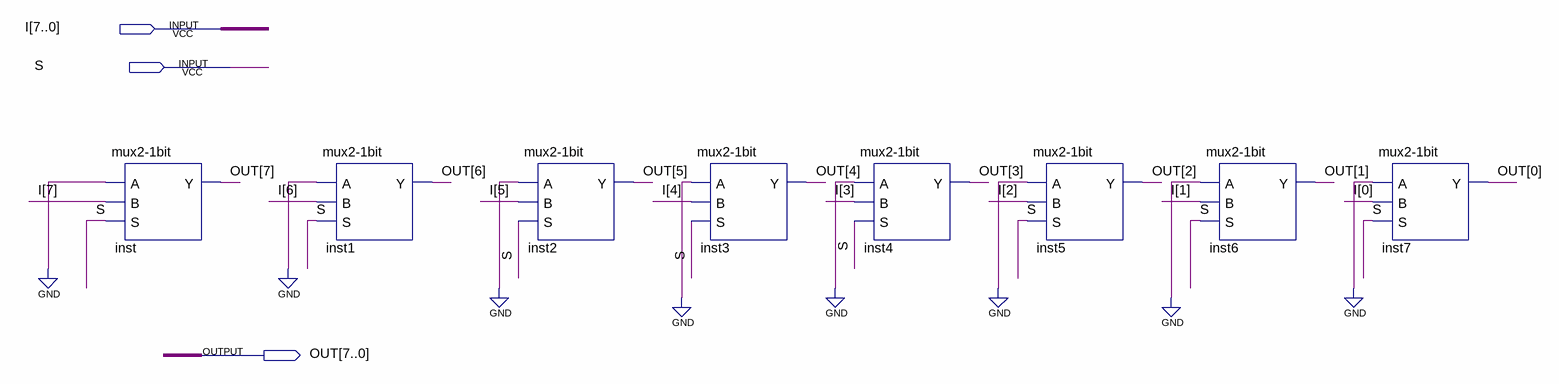
[diagram p0: schematic sheet]
// Quartus schematic MUX_8BITS.bdf as structural Verilog: 8 symbols, 3 pins
module MUX_8BITS (
  input  [7:0] I,
  input  S,
  output [7:0] OUT
);

  \mux2-1bit  inst (.A(1'b0), .B(I[7]), .S(S), .Y(OUT[7]));
  \mux2-1bit  inst1 (.A(1'b0), .B(I[6]), .S(S), .Y(OUT[6]));
  \mux2-1bit  inst2 (.A(1'b0), .B(I[5]), .S(S), .Y(OUT[5]));
  \mux2-1bit  inst3 (.A(1'b0), .B(I[4]), .S(S), .Y(OUT[4]));
  \mux2-1bit  inst4 (.A(1'b0), .B(I[3]), .S(S), .Y(OUT[3]));
  \mux2-1bit  inst5 (.A(1'b0), .B(I[2]), .S(S), .Y(OUT[2]));
  \mux2-1bit  inst6 (.A(1'b0), .B(I[1]), .S(S), .Y(OUT[1]));
  \mux2-1bit  inst7 (.A(1'b0), .B(I[0]), .S(S), .Y(OUT[0]));
endmodule
